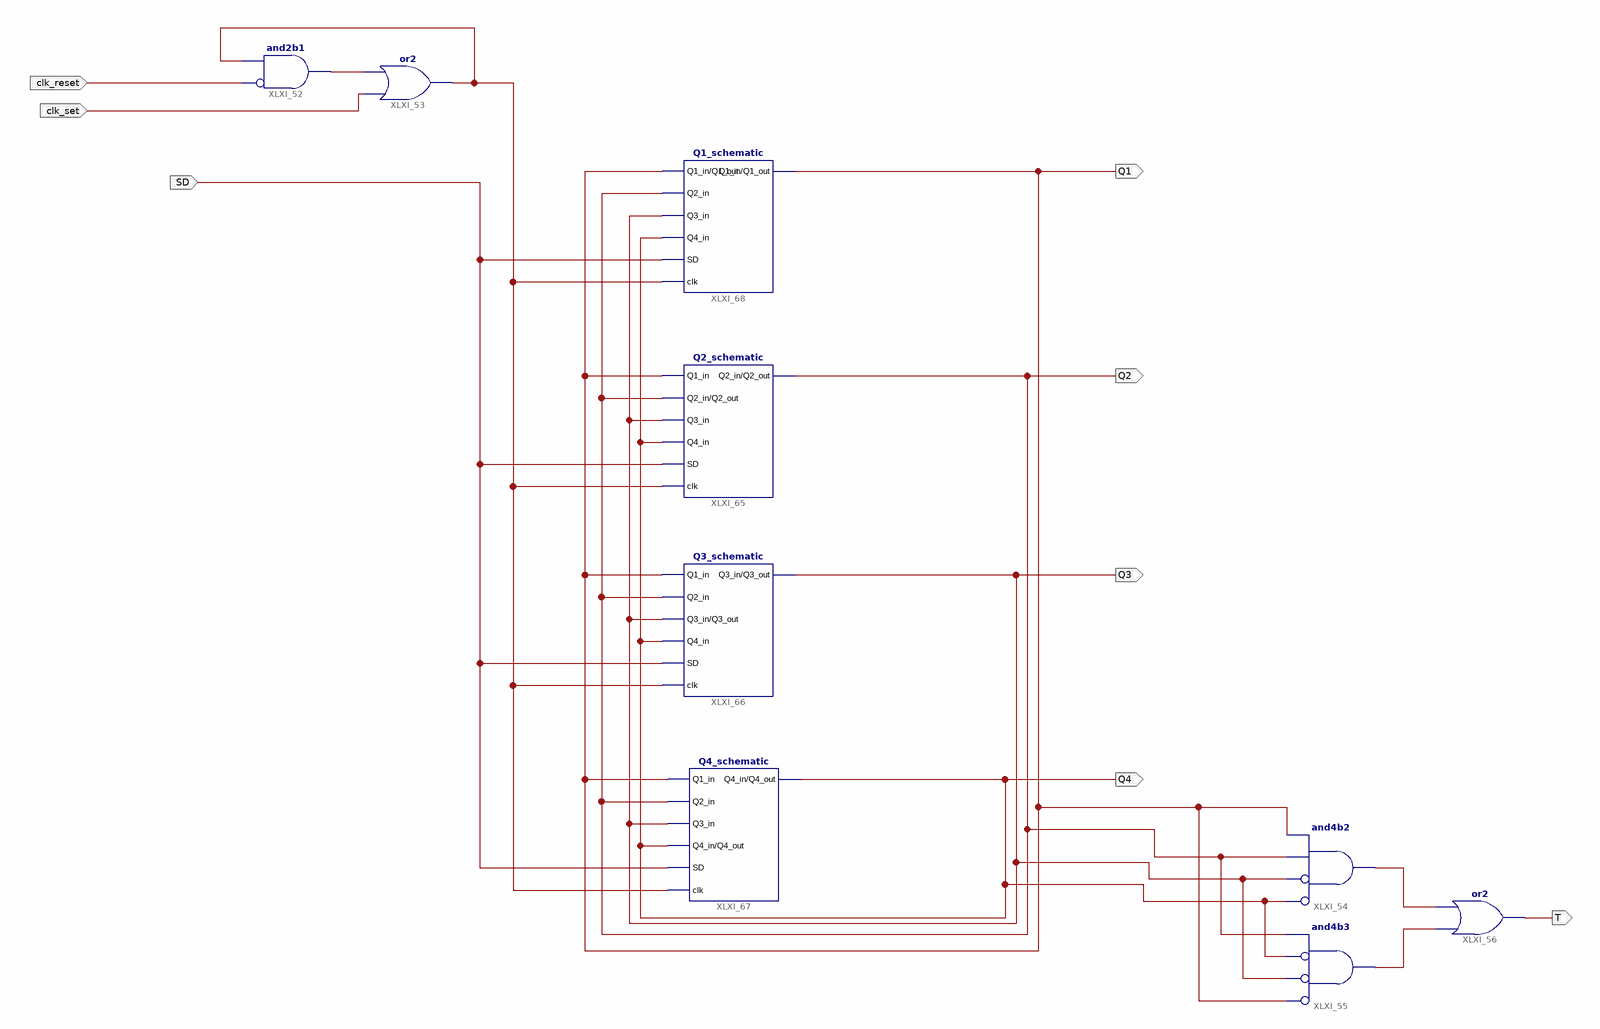
[diagram p0: schematic sheet 1]
// Xilinx ISE schematic overall_schematic.sch (spartan6) as structural Verilog: 9 symbols, 8 ports
module overall_schematic (
  input  clk_set,
  input  clk_reset,
  input  SD,
  output Q1,
  output Q2,
  output Q3,
  output Q4,
  output T
);

  wire XLXN_40, XLXN_42, XLXN_52, XLXN_53;

  and XLXI_52 (XLXN_40, ~clk_reset, XLXN_42);  // and2b1
  or XLXI_53 (XLXN_42, clk_set, XLXN_40);
  and XLXI_54 (XLXN_52, ~Q4, ~Q3, Q2, Q1);  // and4b2
  and XLXI_55 (XLXN_53, ~Q1, ~Q3, ~Q4, Q2);  // and4b3
  or XLXI_56 (T, XLXN_53, XLXN_52);
  Q2_schematic XLXI_65 (.clk(XLXN_42), .Q1_in(Q1), .Q2_in(Q2), .Q2_out(Q2), .Q3_in(Q3), .Q4_in(Q4), .SD(SD));
  Q3_schematic XLXI_66 (.clk(XLXN_42), .Q1_in(Q1), .Q2_in(Q2), .Q3_in(Q3), .Q3_out(Q3), .Q4_in(Q4), .SD(SD));
  Q4_schematic XLXI_67 (.clk(XLXN_42), .Q1_in(Q1), .Q2_in(Q2), .Q3_in(Q3), .Q4_in(Q4), .Q4_out(Q4), .SD(SD));
  Q1_schematic XLXI_68 (.clk(XLXN_42), .Q1_in(Q1), .Q1_out(Q1), .Q2_in(Q2), .Q3_in(Q3), .Q4_in(Q4), .SD(SD));
endmodule
